# Altium project Vreg_Learning_Platform.PrjPcb (part 4 of 4)

## Sheet Safety.SchDoc: <Project Name>
size A3; ApprovedBy: <Appr.>; Author: <Author>; CompanyName: Infineon Technologies AG; Engineer: <Rel.>; Organization: Infineon Technologies AG; Address1: IFAG DES S PS; Address2: Am Campeon 1-12  -  85579 Neubiberg  -  Germany; Address3: 85579 Neubiberg; Address4: Germany; DocumentNumber: 6; Revision: <Rev.>; SheetNumber: 6; SheetTotal: 9; Release: RC00; PageSetup: Record=PageOptions|CenterHorizontal=True|CenterVertical=True|PrintScale=1.01|XCorrection=1.00|YCorrection=1.00|PrintKind=0|BorderSize=5000000|LeftOffset=0|BottomOffset=0|Orientation=2|PaperLength=1000|PaperWidth=1000|Scale=100|PaperSource=7|PrintQuality=-4|MediaType=1|DitherType=10|PaperKind=A3|PrintScaleMode=1; Doc_ConfidentialStatus: <Doc_ConfidentialStatus>; Doc_Preliminary: <Doc_Preliminary>
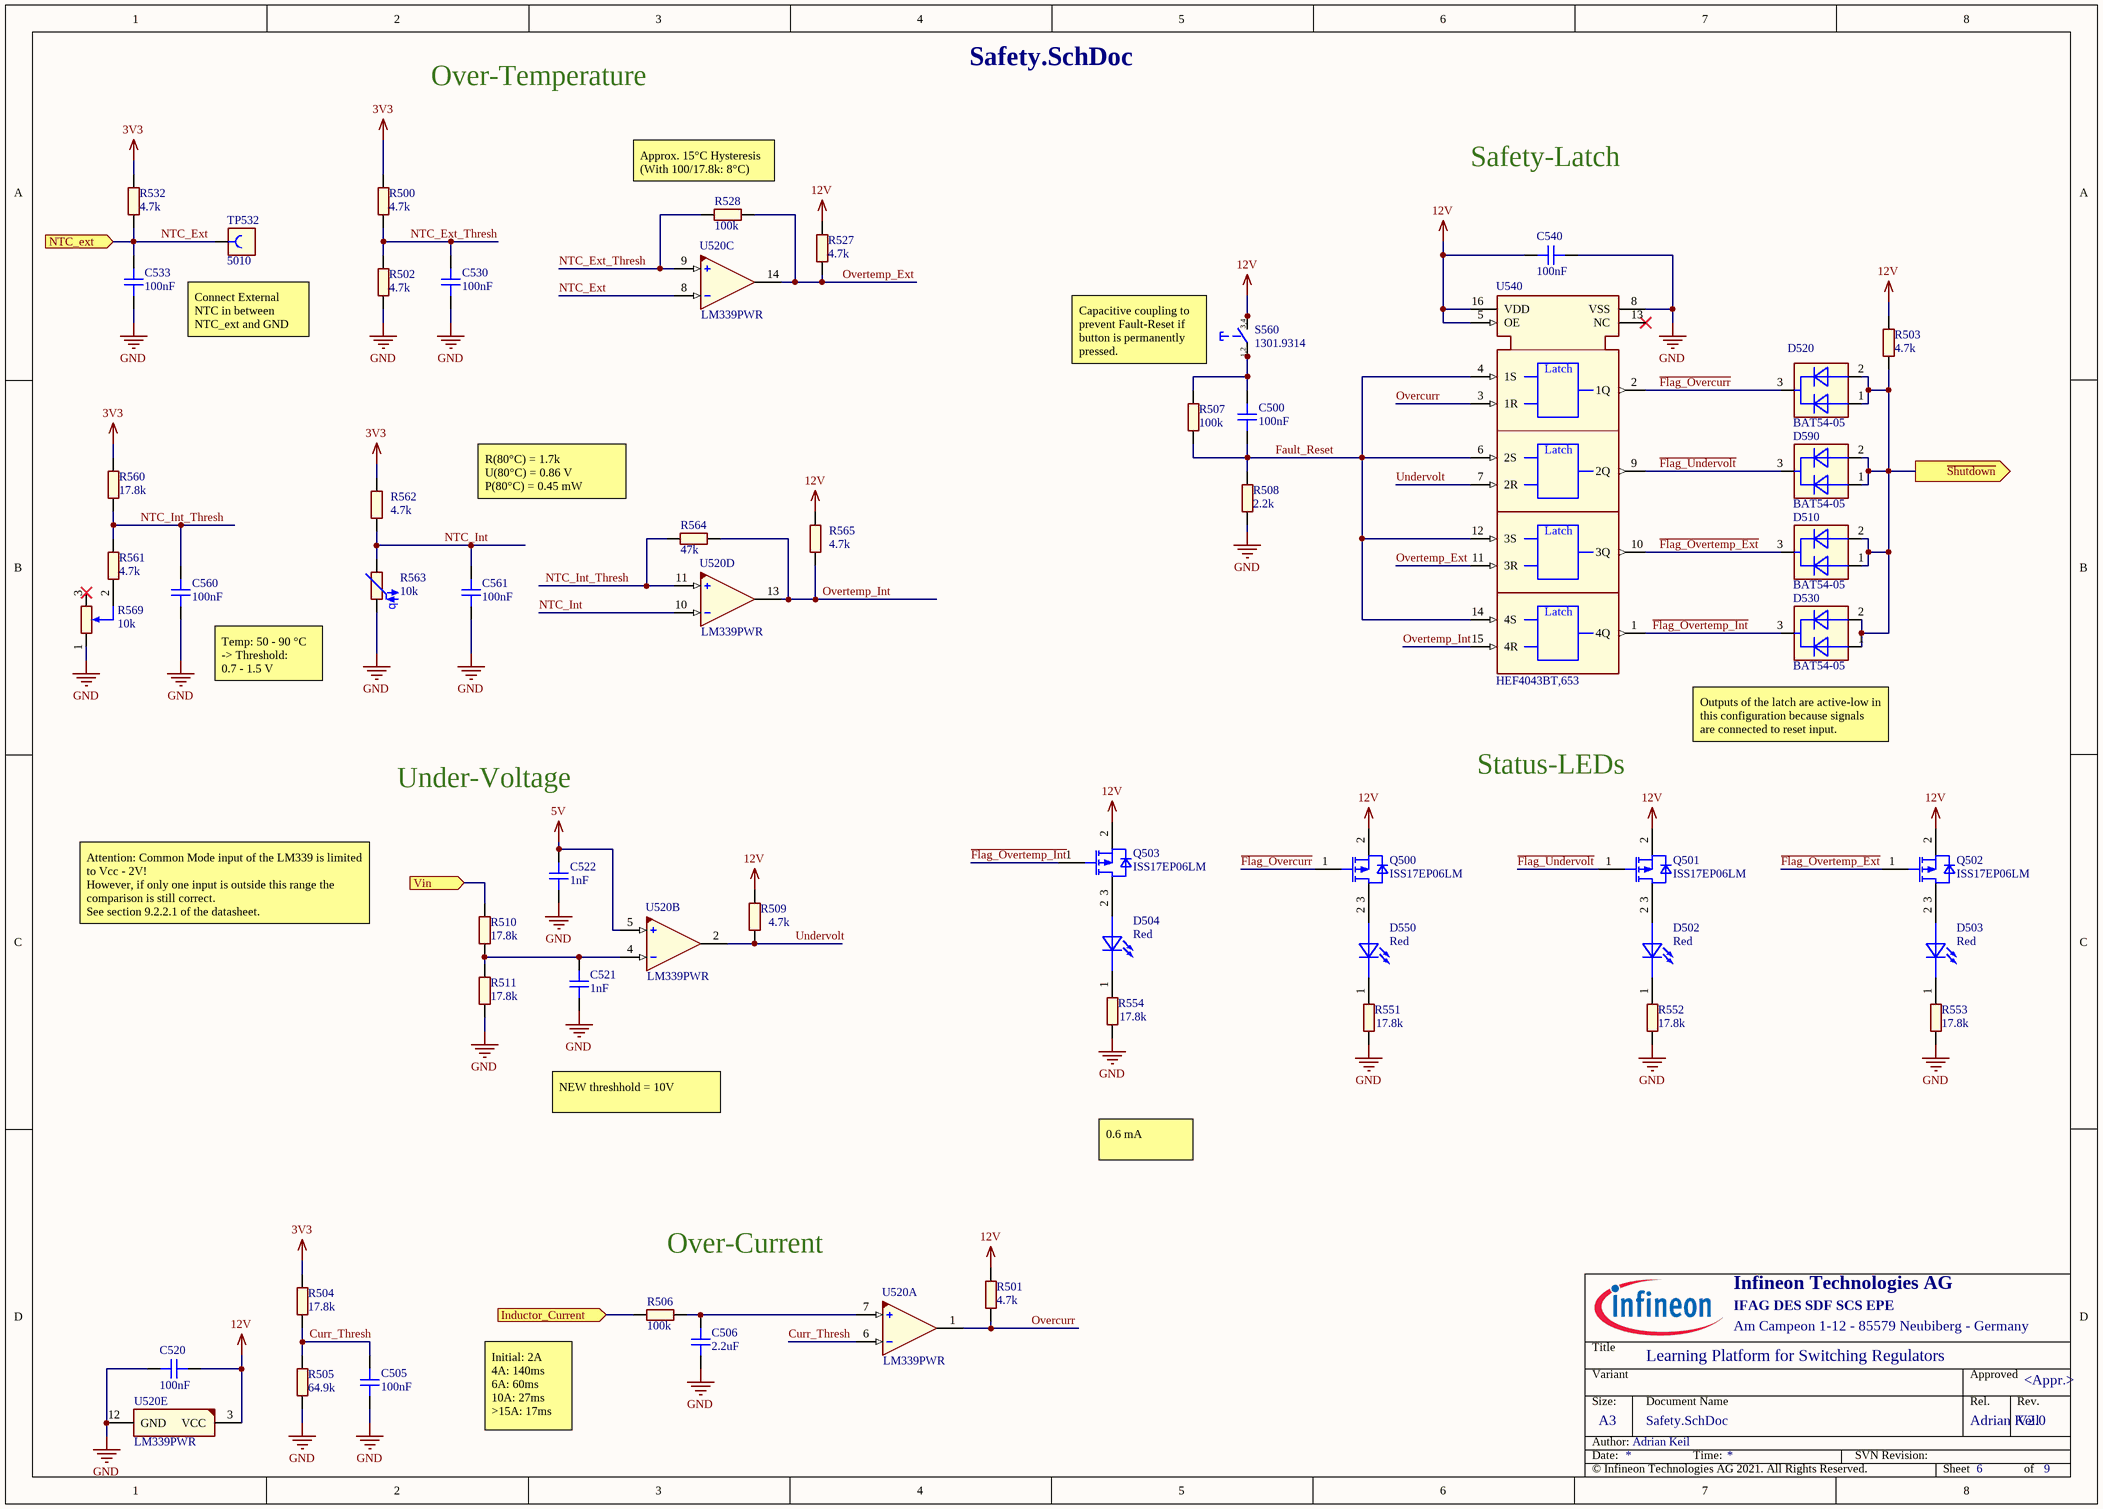
[diagram p4: Safety.SchDoc]

### Parts
C500  100nF  [CAPC3216X125N-0]
C505  100nF  [CAPC3216X125N-0]
C506  2.2uF  [CAPC3216X70N]
C520  100nF  [CAPC3216X125N-0]
C521  1nF  [CAPC3216X95N]
C522  1nF  [CAPC3216X95N]
C530  100nF  [CAPC3216X125N-0]
C533  100nF  [CAPC3216X125N-0]
C540  100nF  [CAPC3216X125N-0]
C560  100nF  [CAPC3216X125N-0]
C561  100nF  [CAPC3216X125N-0]
D502  Red  [LEDSC160X80X80-2N-1]
D503  Red  [LEDSC160X80X80-2N-1]
D504  Red  [LEDSC160X80X80-2N-1]
D510  BAT54-05  [SOT95P240X110-3N-1-V]
D520  BAT54-05  [SOT95P240X110-3N-1-V]
D530  BAT54-05  [SOT95P240X110-3N-1-V]
D550  Red  [LEDSC160X80X80-2N-1]
D590  BAT54-05  [SOT95P240X110-3N-1-V]
Q500  ISS17EP06LM  [SOT95P240X110-3N-1-V]
Q501  ISS17EP06LM  [SOT95P240X110-3N-1-V]
Q502  ISS17EP06LM  [SOT95P240X110-3N-1-V]
Q503  ISS17EP06LM  [SOT95P240X110-3N-1-V]
R500  4.7k  [RESC3216X60N]
R501  4.7k  [RESC3216X60N]
R502  4.7k  [RESC3216X60N]
R503  4.7k  [RESC3216X60N]
R504  17.8k  [RESC3216X60N]
R505  64.9k  [RESC3216X60N]
R506  100k  [RESC3216X60N]
R507  100k  [RESC3216X60N]
R508  2.2k  [RESC3216X60N]
R509  4.7k  [RESC3216X60N]
R510  17.8k  [RESC3216X60N]
R511  17.8k  [RESC3216X60N]
R527  4.7k  [RESC3216X60N]
R528  100k  [RESC3216X60N]
R532  4.7k  [RESC3216X60N]
R551  17.8k  [RESC3216X60N]
R552  17.8k  [RESC3216X60N]
R553  17.8k  [RESC3216X60N]
R554  17.8k  [RESC3216X60N]
R560  17.8k  [RESC3216X60N]
R561  4.7k  [RESC3216X60N]
R562  4.7k  [RESC3216X60N]
R563  10k  [RESC1608X95N-1]
R564  47k  [RESC3216X60N]
R565  4.7k  [RESC3216X60N]
R569  10k  [POT-SMD-3361P]
S560  1301.9314  [SW-SMD-1301.9314]
TP532  5010  [CON-THT-TP-5010]
U520  LM339PWR  [SOP65P640X120-14N-1]  (parts A,B,C,D,E of 5)
U540  HEF4043BT,653  [SOIC127P600X175-16N-6]

### Ports
Inductor_Current (in), NTC_ext (in), Vin (in), ~{Shutdown} (out)

### Nets
3V3: R500.2 R504.2 R532.2 R560.1 R562.2
5V: C522.2 U520.5(2IN_P)
12V: C520.1 C540.2 Q500.2(SOURCE) Q501.2(SOURCE) Q502.2(SOURCE) Q503.2(SOURCE) R501.2 R503.2 R509.2 R527.2 R565.2 S560.3 S560.4 U520.3(VCC) U540.5(OE) U540.16(VDD)
GND: C505.1 C506.1 C520.2 C521.1 C522.1 C530.1 C533.1 C540.1 C560.1 C561.1 R502.1 R505.1 R508.2 R511.1 R551.2 R552.1 R553.1 R554.2 R563.1 R569.1 U520.12(GND) U540.8(VSS)
~{Flag_Overcurr}: D520.3(CATHODE) Q500.1(GATE) U540.2(1Q)
~{Flag_Overtemp_Ext}: D510.3(CATHODE) Q502.1(GATE) U540.10(3Q)
~{Flag_Overtemp_Int}: D530.3(CATHODE) Q503.1(GATE) U540.1(4Q)
~{Flag_Undervolt}: D590.3(CATHODE) Q501.1(GATE) U540.9(2Q)
~{Shutdown}: D510.1(ANODE_1) D510.2(ANODE_2) D520.1(ANODE_1) D520.2(ANODE_2) D530.1(ANODE_1) D530.2(ANODE_2) D590.1(ANODE_1) D590.2(ANODE_2) R503.1 ; port ~{Shutdown}
Curr_Thresh: C505.2 R504.1 R505.2 U520.6(1IN_N)
Fault_Reset: C500.2 R507.1 R508.1 U540.4(1S) U540.6(2S) U540.12(3S) U540.14(4S)
Inductor_Current: R506.1 ; port Inductor_Current
NTC_ext: C533.2 R532.1 TP532.1 U520.8(3IN_N) ; port NTC_ext
NTC_Ext_Thresh: C530.2 R500.1 R502.2 R528.2 U520.9(3IN_P)
NTC_Int: C561.2 R562.1 R563.2 U520.10(4IN_N)
NTC_Int_Thresh: C560.2 R560.2 R561.2 R564.2 U520.11(4IN_P)
Overcurr: R501.1 U520.1(1OUT) U540.3(1R)
Overtemp_Ext: R527.1 R528.1 U520.14(3OUT) U540.11(3R)
Overtemp_Int: R564.1 R565.1 U520.13(4OUT) U540.15(4R)
Undervolt: R509.1 U520.2(2OUT) U540.7(2R)
Vin: R510.1 ; port Vin
NetC500_1: C500.1 R507.2 S560.1 S560.2
NetC506_2: C506.2 R506.2 U520.7(1IN_P)
NetC521_2: C521.2 R510.2 R511.2 U520.4(2IN_N)
NetD502_1: D502.1(Cathode) R552.2
NetD502_2: D502.2(Anode) Q501.3(DRAIN)
NetD503_1: D503.1(Cathode) R553.2
NetD503_2: D503.2(Anode) Q502.3(DRAIN)
NetD504_1: D504.1(Cathode) R554.1
NetD504_2: D504.2(Anode) Q503.3(DRAIN)
NetD550_1: D550.1(Cathode) R551.1
NetD550_2: D550.2(Anode) Q500.3(DRAIN)
NetR561_1: R561.1 R569.2

Not connected (* = marked no-connect by the designer): R569 3*; U540 13(NC)*

### Notes on the sheet
- Over-Temperature
- (near R528) Approx. 15°C Hysteresis
  (With 100/17.8k: 8°C)
- Safety-Latch
- Connect External NTC in between NTC_ext and GND
- Capacitive coupling to prevent Fault-Reset if button is permanently pressed.
- R(80°C) = 1.7k
  U(80°C) = 0.86 V
  P(80°C) = 0.45 mW
  Self-Heating: 1mW/℃ (at 25 °C)
- Temp: 50 - 90 °C
  -> Threshold:
  0.7 - 1.5 V
- Status-LEDs
- (near D530) Outputs of the latch are active-low in this configuration because signals  are connected to reset input.
- Under-Voltage
- Attention: Common Mode input of the LM339 is limited to Vcc - 2V!
  However, if only one input is outside this range the comparison is still correct.
  See section 9.2.2.1 of the datasheet.
- NEW threshhold = 10V
- 0.6 mA
- Over-Current
- Initial: 2A
  4A: 140ms
  6A: 60ms
  10A: 27ms
  >15A: 17ms
- Title
- Variant
- Approved
- Date:
- Author:
- Size:
- A3
- Document Name
- Time:
- SVN Revision:
- Rel.
- Rev.
- Sheet
- of
- (in symbol 380147) 3,4; 1,2
- (in symbol 466242) q
- (in symbol 648079) Latch

### Library data of the parts
C500 C505 C520 C530 C533 C540 C560 C561 = 282874: CAP / CERA / 100nF / 50V / 10% / X7R (EIA) / -55°C to 125°C / 1206(3216) / SMD / -; Multiple Parts: No; Legacy PartNumber: CAP01005660; Manufacturer: MuRata; Manufacturer Order Number: GRM31MR71H104KA01; Symbol Type: Capacitor; Single; Standard; 2 Pins; Alternate View: Yes; Article Number: 282874; Version Number: V01; Combined Parameters: TC:X7R (EIA);Tol.:-10%/+10%;Vdc:50V; QuickPick: 100nF / 50V / 10% / X7R (EIA) / 1206 (3216); Type: Standard; Style: Single; Package Metric: 3216; Package Imperial: 1206; ComponentStatus: Released; PLMStatus: Obsolete; Legacy DeviceID: CAP01005660; Part Type: Capacitor; Value: 100nF; Tolerance Neg: 10%; Tolerance Pos: 10%; Application: Standard; Technology: Ceramic; Temperature min: -55; Temperature max: 125; Temperature Range: Military; ROHS Compliant: Y; Automotive Qualified: No; PackageReference: 1206 (3216); ComponentLink1Description: Vendor WebSite; ComponentLink1URL: http://www.murata.com/; ComponentLink2Description: Datasheet; ComponentLink2URL: http://webnetprod.muc.infineon.com/PCBPortal_Prod/WorkFlows/AltiumComponent/StandardDocumentation?Versionid=282875; Supplier 1: Farnell; Supplier 2: DigiKey; Supplier 3: Mouser; Second Source allowed: Yes; Voltage DC (max): 50V; Package Description: Capacitor,non-polarized,Chip;3.20mm L X 1.60mm W X 1.25mm H
C506 = 279853: CAP / CERA / 2.2uF / 25V / 10% / X5R (EIA) / -55°C to 85°C / 1206(3216) / SMD / -; Multiple Parts: No; Legacy PartNumber: CAP01005015; Manufacturer: MuRata; Manufacturer Order Number: GRM316R61E225KA12; Symbol Type: Capacitor; Single; Standard; 2 Pins; Alternate View: Yes; Article Number: 279853; Version Number: V01; Combined Parameters: TC:X5R (EIA);Tol.:-10%/+10%;Vdc:25V; QuickPick: 2.2uF / 25V / 10% / X5R (EIA) / 1206 (3216); Type: Standard; Style: Single; Package Metric: 3216; Package Imperial: 1206; ComponentStatus: Released; PLMStatus: Not Recommended For New Designs; Legacy DeviceID: CAP01005015; Part Type: Capacitor; Value: 2.2uF; Tolerance Neg: 10%; Tolerance Pos: 10%; Application: Standard; Technology: Ceramic; Temperature min: -55; Temperature max: 85; Temperature Range: Military; ROHS Compliant: Y; Automotive Qualified: No; PackageReference: 1206 (3216); ComponentLink1Description: Vendor WebSite; ComponentLink1URL: http://www.murata.com/; ComponentLink2Description: Datasheet; ComponentLink2URL: http://webnetprod.muc.infineon.com/PCBPortal_Prod/WorkFlows/AltiumComponent/StandardDocumentation?Versionid=279854; Supplier 1: Farnell; Supplier 2: DigiKey; Supplier 3: Mouser; Second Source allowed: Yes; Voltage DC (max): 25V; Package Description: Capacitor,non-polarized,Chip;3.20mm L X 1.60mm W X 0.70mm H
C521 C522 = 280698: CAP / CERA / 1nF / 50V / 10% / X7R (EIA) / -55°C to 125°C / 1206(3216) / SMD / -; Multiple Parts: No; Legacy PartNumber: CAP01005183; Manufacturer: MuRata; Manufacturer Order Number: GRM319R71H102KA01; Symbol Type: Capacitor; Single; Standard; 2 Pins; Alternate View: Yes; Article Number: 280698; Version Number: V01; Combined Parameters: TC:X7R (EIA);Tol.:-10%/+10%;Vdc:50V; QuickPick: 1nF / 50V / 10% / X7R (EIA) / 1206 (3216); Type: Standard; Style: Single; Package Metric: 3216; Package Imperial: 1206; ComponentStatus: Released; PLMStatus: Obsolete; Legacy DeviceID: CAP01005183; Part Type: Capacitor; Value: 1nF; Tolerance Neg: 10%; Tolerance Pos: 10%; Application: Standard; Technology: Ceramic; Temperature min: -55; Temperature max: 125; Temperature Range: Military; ROHS Compliant: Y; Automotive Qualified: No; PackageReference: 1206 (3216); ComponentLink1Description: Vendor WebSite; ComponentLink1URL: http://www.murata.com/; ComponentLink2Description: Datasheet; ComponentLink2URL: http://webnetprod.muc.infineon.com/PCBPortal_Prod/WorkFlows/AltiumComponent/StandardDocumentation?Versionid=280699; Supplier 1: Farnell; Supplier 2: DigiKey; Supplier 3: Mouser; Second Source allowed: Yes; Voltage DC (max): 50V; Package Description: Capacitor,non-polarized,Chip;3.20mm L X 1.60mm W X 0.95mm H
D502-D504 D550 = 625459: WL-SMCW SMT Mono-color Chip LED Waterclear, Red,630nm; Manufacturer: Wurth Elektronik; Manufacturer Order Number: 150060RS75000; Symbol Type: Standard LED Symbol, 1 Cathode, 2 Anode; Article Number: 625459; Version Number: V01; Combined Parameters: Vf:2.4V;If:30mA;Ur:5V;Ir:10uA;Pmax:72mW; QuickPick: LED / 1608 (0603); Style: Single; Automotive Qualified: No; ComponentStatus: Released; PLMStatus: Active; Second Source allowed: Yes; Voltage DC (max): na; Part Type: Diode; Value: Red; Type: LED; Application: Standard; Temperature min: -40; Temperature max: 85; Temperature Range: Industrial; ROHS Compliant: Y; PackageReference: 1608 (0603); ComponentLink1Description: Vendor WebSite; ComponentLink1URL: http://www.we-online.com; ComponentLink2Description: Datasheet; ComponentLink2URL: http://webnetprod.muc.infineon.com/PCBPortal_Prod/WorkFlows/AltiumComponent/StandardDocumentation?Versionid=625460; Supplier 1: Farnell; Supplier Part Number 1: 2322071; Supplier 2: DigiKey; Supplier Part Number 2: 732-4978-1-ND; Supplier 3: Mouser; Supplier Part Number 3: 710-150060RS75000; Package Description: LED,Side Concave; 2 pin,1.60mm W X 0.80mm L X 0.80mm H
D510 D520 D530 D590 = 430837: Silicon Schottky Diode, LS(nH) 1.8, VR 30V; Legacy PartNumber: IFX01401370; Manufacturer: Infineon Technologies; Symbol type: Dual Diode Symbol 3 Pins, 1 Anode, 2 Anode, 3 Cathode; Article Number: 430837; Version Number: V01; Combined Parameters: Vf:800mV;If:200mA;Ur:30V;Ir:2uA;Pmax:230mW; QuickPick: Schottky Diode / PG-SOT23-3-11; Style: Dual; Automotive Qualified: AEC Q101; ComponentStatus: Released; PLMStatus: Active; Second Source allowed: Yes; Voltage DC (max): na; Legacy DeviceID: IFX01401370; Part Type: Diode; Manufacturer Order Number: BAT54-05; Value: BAT54-05; Type: Schottky Diode; Application: Standard; Temperature min: 0; Temperature max: 150; Temperature Range: Military; ROHS Compliant: Y; PackageReference: PG-SOT23-3-11; ComponentLink1Description: Vendor WebSite; ComponentLink1URL: https://www.infineon.com/; ComponentLink2Description: Datasheet; ComponentLink2URL: http://webnetprod.muc.infineon.com/PCBPortal_Prod/WorkFlows/AltiumComponent/StandardDocumentation?Versionid=430838; Supplier 1: Farnell; Supplier Part Number 1: 2725759; Supplier 2: DigiKey; Supplier Part Number 2: BAT5405E6327HTSA1TR-ND; Supplier 3: Mouser; Supplier Part Number 3: 726-BAT5405E6327HTSA; Package Description: SOT,0.95mm pitch;3 pin,1.30mm W X 2.90mm L X 1.10mm H body
Q500-Q503 = 615536: OptiMOSTM Small Signal Transistor, -60 V; Manufacturer: Infineon Technologies; Symbol Type: Insulated-Gate Field-Effect Transistor (IGFET), P-Channel, Enhancement,  Body Diode, Pin 1 Gate, 2 Source, 3 Drain, 3 Pins; Article Number: 615536; Version Number: V01; Legacy DeviceID: IFX_ISS17EP06LM; Combined Parameters: P-Channel Enhancement;Uds:-60V;Id:-300mA;Rds:1.7R;P:360mW; QuickPick: P-Channel Enhancement / 360mW / -300mA / -60V / PG-SOT23-3-5; Type: P-Channel Enhancement; Style: Single; Automotive Qualified: No; ComponentStatus: Released; PLMStatus: Active; Second Source allowed: Yes; Voltage DC (max): na; Part Type: Transistor FET; Manufacturer Order Number: ISS17EP06LM; Value: ISS17EP06LM; Application: Small Signal; Temperature min: -55; Temperature max: 150; Temperature Range: Military; ROHS Compliant: Y; PackageReference: PG-SOT23-3-5; ComponentLink1Description: Vendor WebSite; ComponentLink1URL: https://www.infineon.com/; ComponentLink2Description: Datasheet; ComponentLink2URL: http://webnetprod.muc.infineon.com/PCBPortal_Prod/WorkFlows/AltiumComponent/StandardDocumentation?Versionid=615537; Supplier 1: Farnell; Supplier Part Number 1: 3267800; Supplier 2: DigiKey; Supplier Part Number 2: 448-ISS17EP06LMXTSA1CT-ND; Supplier 3: Mouser; Supplier Part Number 3: 726-ISS17EP06LMXTSA1; Package Description: SOT,0.95mm,pitch;3 pin,1.30mm W X 2.90mm L X 1.10mm H body
R500-R503 R509 R527 R532 R561 R562 R565 = 353992: RES / STD / 4.7k / 250mW / 1% / 100ppm/K / -55°C to 155°C / 1206(3216) / SMD / -; Multiple Parts: No; Legacy PartNumber: RES01802819; Manufacturer: Vishay; Manufacturer Order Number: CRCW12064K70FK; Symbol Type: Resistor; Single; Standard; 2 Pins; Alternate View: Yes; Article Number: 353992; Version Number: V01; Combined Parameters: TCR:100ppm/K;Tol.:-1%/+1%;Vdc:200V;Idc:-;P:250mW; QuickPick: 4.7k / 1% / 0.25 / 1206 (3216); Style: Single; Automotive Qualified: AEC Q200; Package Metric: 3216; Package Imperial: 1206; ComponentStatus: Released; PLMStatus: Active; Voltage DC (max): 200V; Legacy DeviceID: RES01802819; Part Type: Resistor; Value: 4.7k; Tolerance Neg: 1%; Tolerance Pos: 1%; Type: Standard; Technology: Thick Film; Temperature min: -55; Temperature max: 155; Temperature Range: Military; ROHS Compliant: Y; PackageReference: 1206 (3216); ComponentLink1Description: Vendor WebSite; ComponentLink1URL: http://www.vishay.com; ComponentLink2Description: Datasheet; ComponentLink2URL: http://webnetprod.muc.infineon.com/PCBPortal_Prod/WorkFlows/AltiumComponent/StandardDocumentation?Versionid=353993; Supplier 1: Farnell; Supplier 2: DigiKey; Supplier 3: Mouser; Second Source allowed: Yes
R504 R510 R511 R551-R554 R560 = 354312: RES / STD / 17.8k / 250mW / 1% / 100ppm/K / -55°C to 155°C / 1206(3216) / SMD / -; Multiple Parts: No; Legacy PartNumber: RES01802883; Manufacturer: Vishay; Manufacturer Order Number: CRCW120617K8FK; Symbol Type: Resistor; Single; Standard; 2 Pins; Alternate View: Yes; Article Number: 354312; Version Number: V01; Combined Parameters: TCR:100ppm/K;Tol.:-1%/+1%;Vdc:200V;Idc:-;P:250mW; QuickPick: 17.8k / 1% / 0.25 / 1206 (3216); Style: Single; Automotive Qualified: AEC Q200; Package Metric: 3216; Package Imperial: 1206; ComponentStatus: Released; PLMStatus: Active; Voltage DC (max): 200V; Legacy DeviceID: RES01802883; Part Type: Resistor; Value: 17.8k; Tolerance Neg: 1%; Tolerance Pos: 1%; Type: Standard; Technology: Thick Film; Temperature min: -55; Temperature max: 155; Temperature Range: Military; ROHS Compliant: Y; PackageReference: 1206 (3216); ComponentLink1Description: Vendor WebSite; ComponentLink1URL: http://www.vishay.com; ComponentLink2Description: Datasheet; ComponentLink2URL: http://webnetprod.muc.infineon.com/PCBPortal_Prod/WorkFlows/AltiumComponent/StandardDocumentation?Versionid=354313; Supplier 1: Farnell; Supplier 2: DigiKey; Supplier 3: Mouser; Second Source allowed: Yes
R505 = 354647: RES / STD / 64.9k / 250mW / 1% / 100ppm/K / -55°C to 155°C / 1206(3216) / SMD / -; Multiple Parts: No; Legacy PartNumber: RES01802950; Manufacturer: Vishay; Manufacturer Order Number: CRCW120664K9FK; Symbol Type: Resistor; Single; Standard; 2 Pins; Alternate View: Yes; Article Number: 354647; Version Number: V01; Combined Parameters: TCR:100ppm/K;Tol.:-1%/+1%;Vdc:200V;Idc:-;P:250mW; QuickPick: 64.9k / 1% / 0.25 / 1206 (3216); Style: Single; Automotive Qualified: AEC Q200; Package Metric: 3216; Package Imperial: 1206; ComponentStatus: Released; PLMStatus: Active; Voltage DC (max): 200V; Legacy DeviceID: RES01802950; Part Type: Resistor; Value: 64.9k; Tolerance Neg: 1%; Tolerance Pos: 1%; Type: Standard; Technology: Thick Film; Temperature min: -55; Temperature max: 155; Temperature Range: Military; ROHS Compliant: Y; PackageReference: 1206 (3216); ComponentLink1Description: Vendor WebSite; ComponentLink1URL: http://www.vishay.com; ComponentLink2Description: Datasheet; ComponentLink2URL: http://webnetprod.muc.infineon.com/PCBPortal_Prod/WorkFlows/AltiumComponent/StandardDocumentation?Versionid=354648; Supplier 1: Farnell; Supplier 2: DigiKey; Supplier 3: Mouser; Second Source allowed: Yes
R506 R507 R528 = 354752: RES / STD / 100k / 250mW / 1% / 100ppm/K / -55°C to 155°C / 1206(3216) / SMD / -; Multiple Parts: No; Legacy PartNumber: RES01802971; Manufacturer: Vishay; Manufacturer Order Number: CRCW1206100KFK; Symbol Type: Resistor; Single; Standard; 2 Pins; Alternate View: Yes; Article Number: 354752; Version Number: V01; Combined Parameters: TCR:100ppm/K;Tol.:-1%/+1%;Vdc:200V;Idc:-;P:250mW; QuickPick: 100k / 1% / 0.25 / 1206 (3216); Style: Single; Automotive Qualified: AEC Q200; Package Metric: 3216; Package Imperial: 1206; ComponentStatus: Released; PLMStatus: Active; Voltage DC (max): 200V; Legacy DeviceID: RES01802971; Part Type: Resistor; Value: 100k; Tolerance Neg: 1%; Tolerance Pos: 1%; Type: Standard; Technology: Thick Film; Temperature min: -55; Temperature max: 155; Temperature Range: Military; ROHS Compliant: Y; PackageReference: 1206 (3216); ComponentLink1Description: Vendor WebSite; ComponentLink1URL: http://www.vishay.com; ComponentLink2Description: Datasheet; ComponentLink2URL: http://webnetprod.muc.infineon.com/PCBPortal_Prod/WorkFlows/AltiumComponent/StandardDocumentation?Versionid=354753; Supplier 1: Farnell; Supplier 2: DigiKey; Supplier 3: Mouser; Second Source allowed: Yes
R508 = 353792: RES / STD / 2.2k / 250mW / 1% / 100ppm/K / -55°C to 155°C / 1206(3216) / SMD / -; Multiple Parts: No; Legacy PartNumber: RES01802779; Manufacturer: Vishay; Manufacturer Order Number: CRCW12062K20FK; Symbol Type: Resistor; Single; Standard; 2 Pins; Alternate View: Yes; Article Number: 353792; Version Number: V01; Combined Parameters: TCR:100ppm/K;Tol.:-1%/+1%;Vdc:200V;Idc:-;P:250mW; QuickPick: 2.2k / 1% / 0.25 / 1206 (3216); Style: Single; Automotive Qualified: AEC Q200; Package Metric: 3216; Package Imperial: 1206; ComponentStatus: Released; PLMStatus: Active; Voltage DC (max): 200V; Legacy DeviceID: RES01802779; Part Type: Resistor; Value: 2.2k; Tolerance Neg: 1%; Tolerance Pos: 1%; Type: Standard; Technology: Thick Film; Temperature min: -55; Temperature max: 155; Temperature Range: Military; ROHS Compliant: Y; PackageReference: 1206 (3216); ComponentLink1Description: Vendor WebSite; ComponentLink1URL: http://www.vishay.com; ComponentLink2Description: Datasheet; ComponentLink2URL: http://webnetprod.muc.infineon.com/PCBPortal_Prod/WorkFlows/AltiumComponent/StandardDocumentation?Versionid=353793; Supplier 1: Farnell; Supplier 2: DigiKey; Supplier 3: Mouser; Second Source allowed: Yes
R563 = 466242: RES / NTC / 10k / 100mW / 1% / - / -40°C to 125°C / 0603(1608) / SMD / -; Multiple Parts: No; Legacy PartNumber: RES01806219; Manufacturer: MuRata; Manufacturer Order Number: NCP18XH103F03RB; Symbol Type: Resistor; Single; Negative Temperature Coefficient; 2 Pins; Alternate View: Yes; Article Number: 466242; Version Number: V01; Combined Parameters: TCR:-;Tol.:-1%/+1%;Vdc:-;Idc:-;P:100mW; QuickPick: 10k / 1% / 0.1 / 0603; Style: Single; Package Metric: 1608; Package Imperial: 0603; ComponentStatus: Released; PLMStatus: Active; Legacy DeviceID: RES01806219; Part Type: Resistor; Value: 10k; Tolerance Neg: 1%; Tolerance Pos: 1%; Type: Negative Temperature Coefficient (NTC); Temperature min: -40; Temperature max: 125; Temperature Range: Automotive; ROHS Compliant: Y; Automotive Qualified: No; PackageReference: 0603; ComponentLink1Description: Vendor WebSite; ComponentLink1URL: http://www.murata.com/; ComponentLink2Description: Datasheet; ComponentLink2URL: http://webnetprod.muc.infineon.com/PCBPortal_Prod/WorkFlows/AltiumComponent/StandardDocumentation?Versionid=466243; Supplier 1: Farnell; Supplier Part Number 1: 2456122RL; Supplier 2: DigiKey; Supplier Part Number 2: 490-4800-2-ND; Supplier 3: Mouser; Supplier Part Number 3: 81-NCP18XH103F03RB; Second Source allowed: Yes; Package Description: Resistor,Chip;1.60mm L X 0.80mm W X 0.95mm H
R564 = 354562: RES / STD / 47k / 250mW / 1% / 100ppm/K / -55°C to 155°C / 1206(3216) / SMD / -; Multiple Parts: No; Legacy PartNumber: RES01802933; Manufacturer: Vishay; Manufacturer Order Number: CRCW120647K0FK; Symbol Type: Resistor; Single; Standard; 2 Pins; Alternate View: Yes; Article Number: 354562; Version Number: V01; Combined Parameters: TCR:100ppm/K;Tol.:-1%/+1%;Vdc:200V;Idc:-;P:250mW; QuickPick: 47k / 1% / 0.25 / 1206 (3216); Style: Single; Automotive Qualified: AEC Q200; Package Metric: 3216; Package Imperial: 1206; ComponentStatus: Released; PLMStatus: Active; Voltage DC (max): 200V; Legacy DeviceID: RES01802933; Part Type: Resistor; Value: 47k; Tolerance Neg: 1%; Tolerance Pos: 1%; Type: Standard; Technology: Thick Film; Temperature min: -55; Temperature max: 155; Temperature Range: Military; ROHS Compliant: Y; PackageReference: 1206 (3216); ComponentLink1Description: Vendor WebSite; ComponentLink1URL: http://www.vishay.com; ComponentLink2Description: Datasheet; ComponentLink2URL: http://webnetprod.muc.infineon.com/PCBPortal_Prod/WorkFlows/AltiumComponent/StandardDocumentation?Versionid=354563; Supplier 1: Farnell; Supplier 2: DigiKey; Supplier 3: Mouser; Second Source allowed: Yes
R569 = 630020: RES / VAR / 10k / 500mW / 10% / 100ppm/K / -55°C to 125°C /  3 pin, 7.04 mm L X 6.71 mm W X 5.84 mm H Body / SMD / -; Multiple Parts: No; Manufacturer: Bourns; Manufacturer Order Number: 3361P-1-103GLF; Alternate View: Yes; Symbol Type: Resistor; Single; Variable; 3 Pins; Article Number: 630020; Version Number: V01; Combined Parameters: TCR:100ppm/K;Tol.:-10%/+10%;Vdc:-;Idc:-;P:500mW; QuickPick: 10k / 10% / 0.5 / SMD; Style: Single; ComponentStatus: Released; PLMStatus: Active; Part Type: Resistor; Value: 10k; Tolerance Neg: 10%; Tolerance Pos: 10%; Type: Variable; Application: Standard; Temperature min: -55; Temperature max: 125; Temperature Range: Military; ROHS Compliant: Y; Automotive Qualified: No; PackageReference: SMD; ComponentLink1Description: Vendor WebSite; ComponentLink1URL: http://www.bourns.com; ComponentLink2Description: Datasheet; ComponentLink2URL: http://webnetprod.muc.infineon.com/PCBPortal_Prod/WorkFlows/AltiumComponent/StandardDocumentation?Versionid=630021; Supplier 1: Farnell; Supplier Part Number 1: 1696060; Supplier 2: DigiKey; Supplier Part Number 2: 3361P-103GLFCT-ND; Supplier 3: Mouser; Supplier Part Number 3: 652-3361P-1-103GLF; Second Source allowed: Yes; Package Description: Potentiometer, SMD; 3 pin, 7.04 mm L X 6.71 mm W X 5.84 mm H Body
S560 = 380147: Pushbutton Tactile Switch, Single Pole Single Throw, 4 Pins; Legacy PartNumber: CON01500305; Manufacturer: Schurter; Symbol type: Tactile Switch, Spring Return, Single Pole Single Throw - Normally Open, 4 Pins; Article Number: 380147; Version Number: V01; Legacy DeviceID: SCH_1301.9314; ComponentStatus: Released; PLMStatus: Active; Second Source allowed: Yes; Voltage DC (max): na; Part Type: Electro Mechanic; Manufacturer Order Number: 1301.9314; Value: 1301.9314; Temperature min: -20; Temperature max: 70; Temperature Range: Commercial; ROHS Compliant: Y; ComponentLink1Description: Vendor WebSite; ComponentLink1URL: http://www.schurter.com.sg/; ComponentLink2Description: Datasheet; ComponentLink2URL: http://webnetprod.muc.infineon.com/PCBPortal_Prod/WorkFlows/AltiumComponent/StandardDocumentation?Versionid=380148; Supplier 1: Farnell; Supplier Part Number 1: 1217763; Supplier 2: DigiKey; Supplier Part Number 2: 1301.9314-ND; Supplier 3: Mouser; Supplier Part Number 3: 693-1301.9314; Package Description: SMD Switch, 6.00mm L X 6.00mm W X 4.3mm H body
TP532 = 382400: PC Test Point-Multipurpose THT, Red; Multiple Parts: No; Legacy PartNumber: CON01500529; Manufacturer: Keystone Electronics Corp.; Symbol Type: Connector, 1 Lead, Female; Alternate View: Yes; Article Number: 382400; Version Number: V01; Legacy DeviceID: KEY_5010; Combined Parameters: Board-to-Cable None (onboard);1x1;Mounting:THT;Orient:0° (vertical);Shielded:No; QuickPick: 0° (vertical) / Board-to-Cable; Style: Not Applicable; ComponentStatus: Released; PLMStatus: Active; Voltage DC (max): na; Part Type: Connector; Manufacturer Order Number: 5010; Value: 5010; Type: Board-to-Cable; Application: Test; Temperature min: 0; Temperature max: 0; Temperature Range: Military; ROHS Compliant: Y; Automotive Qualified: No; ComponentLink1Description: Vendor WebSite; ComponentLink1URL: http://www.keyelco.com/; ComponentLink2Description: Datasheet; ComponentLink2URL: http://webnetprod.muc.infineon.com/PCBPortal_Prod/WorkFlows/AltiumComponent/StandardDocumentation?Versionid=382401; Supplier 1: Farnell; Supplier Part Number 1: 2301288; Supplier 2: DigiKey; Supplier Part Number 2: 36-5010-ND; Supplier 3: Mouser; Supplier Part Number 3: 534-5010; Second Source allowed: Yes; Package Description: Test Point, 1.78 mm Lead Width, Round, 3.17 mm Dia X 8.28 mm H body
U520 = 409035: Quad Differential Comparator; Legacy PartNumber: IC02600564; Manufacturer: Texas Instruments; Alternate View: Yes; Article Number: 409035; Version Number: V01; Legacy DeviceID: TI_LM339; Combined Parameters: Res.:-;Fmax:-; QuickPick: TSSOP-14 (PW); Automotive Qualified: No; ComponentStatus: Released; PLMStatus: Active; Voltage DC (max): na; Symbol Type: Quad Differential Comparator; Part Type: Analog Parts; Manufacturer Order Number: LM339PWR; Value: LM339PWR; Temperature min: 0; Temperature max: 0; Temperature Range: Military; PackageReference: TSSOP-14 (PW); ComponentLink1Description: Vendor WebSite; ComponentLink1URL: http://www.ti.com; ComponentLink2Description: Datasheet; ComponentLink2URL: http://webnetprod.muc.infineon.com/PCBPortal_Prod/WorkFlows/AltiumComponent/StandardDocumentation?Versionid=409036; Supplier 1: Farnell; Supplier Part Number 1: 2436009; Supplier 2: DigiKey; Supplier Part Number 2: 296-6607-2-ND; Supplier 3: Mouser; Supplier Part Number 3: 595-LM339PWR; Second Source allowed: Yes
U540 = 648079: Quad R/S latch with 3-state outputs; Multiple Parts: No; Manufacturer: Nexperia; Article Number: 648079; Version Number: V00; Legacy DeviceID: NEX_HEF4043BT,653; Combined Parameters: - Digital;Vdc min/max:3V/15V;Iout:2.4mA;Fmax:-; QuickPick: SO-16; ComponentStatus: Released; PLMStatus: Active; Second Source allowed: Yes; Voltage DC (max): na; Symbol Type: Quad R/S latch with 3-state outputs; Alternate View: No; Part Type: Integrated Circuit; Manufacturer Order Number: HEF4043BT,653; Value: HEF4043BT,653; Type: Digital; Temperature min: -40; Temperature max: 85; Temperature Range: Industrial; ROHS Compliant: Y; Automotive Qualified: No; PackageReference: SO-16; ComponentLink1Description: Vendor WebSite; ComponentLink1URL: http://www.nexperia.com; ComponentLink2Description: Datasheet; ComponentLink2URL: http://webnetprod.muc.infineon.com/PCBPortal_Prod/WorkFlows/AltiumComponent/StandardDocumentation?Versionid=648080; Supplier 1: Farnell; Supplier 2: DigiKey; Supplier Part Number 2: 1727-1799-1-ND; Supplier 3: Mouser; Supplier Part Number 3: 771-HEF4043BT653; Package Description: SOIC,1.27mm pitch;16 pin,3.90mm W X 9.90mm L X 1.75mm H body

## Nets that join several sheets
3V3: 02_Top_Level (6 pins), PowerStage (6 pins), PowerSupply (C311.2 C312.2 G310.4 TP310.1), Safety (5 pins)
5V: 02_Top_Level (D112.2 X140.3), PowerSupply (6 pins), Safety (C522.2 U520.5)
12V: 02_Top_Level (X140.2), Input (C630.2 U630.7), PowerStage (C400.2 U400.5), PowerSupply (C301.2 G300.14 R301.1 TP300.1), Safety (16 pins)
GND: 02_Top_Level (22 pins), Input (15 pins), PowerStage (24 pins), PowerSupply (19 pins), Safety (22 pins)
~{Shutdown}: 02_Top_Level (R112.1), PowerStage (U400.2), Safety (9 pins)
Buck_Cntrl: 02_Top_Level (R122.1 S122.2), PowerStage (TP400.1 U400.1)
Inductor_Current: 02_Top_Level (R111.2 X140.7), PowerStage (TP600.1 U420.5 U421.5), Safety (R506.1)
Input_Current: 02_Top_Level (R110.2 X140.6), Input (R634.2 TP630.1 U630.6)
NetQ200_2: 02_Top_Level (X100.1 X100.2), Input (Q200.2)
NTC_ext: 02_Top_Level (190.9 X110.6B), Safety (C533.2 R532.1 TP532.1 U520.8)
Vin: 02_Top_Level (X140.1), Input (8 pins), PowerStage (5 pins), PowerSupply (7 pins), Safety (R510.1)
Vin_Meas: 02_Top_Level (X110.4B XMC2GO.4), Input (C221.2 R220.2 R221.1)
Vout: 02_Top_Level (190.1 190.2 X140.8), PowerStage (11 pins)
Vout_Meas: 02_Top_Level (X110.5B X140.9 XMC2GO.2), PowerStage (R721.1 R722.1 X400.1)

## Assembly variants
Default_Assembly: not fitted C312 C511 C515 C521 C522 C600 C? JP421 MP100 MP100 MP101 MP101 MP102 MP102 MP103 MP103 R213 TP611 U420 U421 X110 X?
OnlySMD: not fitted C210 C312 C511 C515 C521 C522 C600 JP110 JP110 JP111 JP111 JP111 JP112 JP120 JP121 JP122 JP122 JP123 JP124 JP125 JP126 JP127 JP128 JP130 JP212 JP421 JP421 JP421 JP701 JP710 JP710 JP710 JP710 JP710 JP723 MP100 MP100 MP101 MP101 MP102 MP102 MP103 MP103 R213 R509 R513 TP100 TP100 TP101 TP101 TP102 TP102 TP103 TP103 TP103 TP104 TP104 TP105 TP105 TP106 TP107 TP202 TP300 TP300 TP421 TP421 TP503 TP611 TP710 TP802 U420 U421 X100 X101 X110 X110 X140 X140 X140 X140 X140 X140 X140 X150 X150 X150 X720 X720 X720 X?